# EAGLE board Octal (EAGLE 9.4.1)
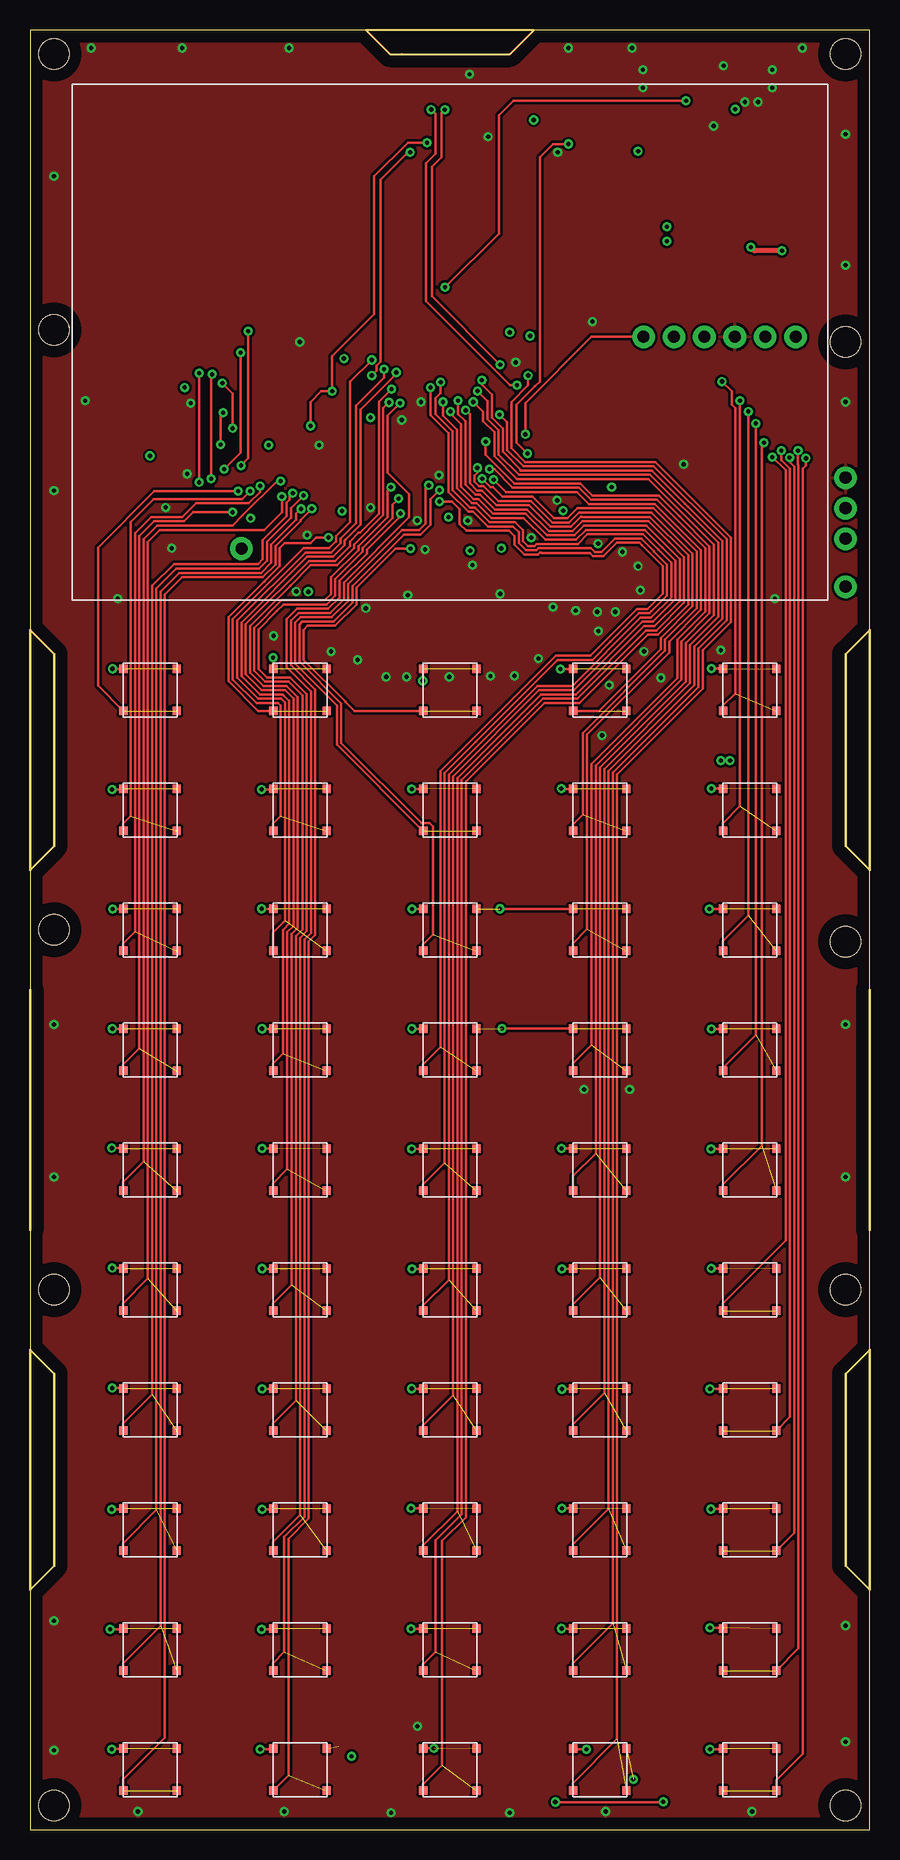
[diagram p6: board, top side]
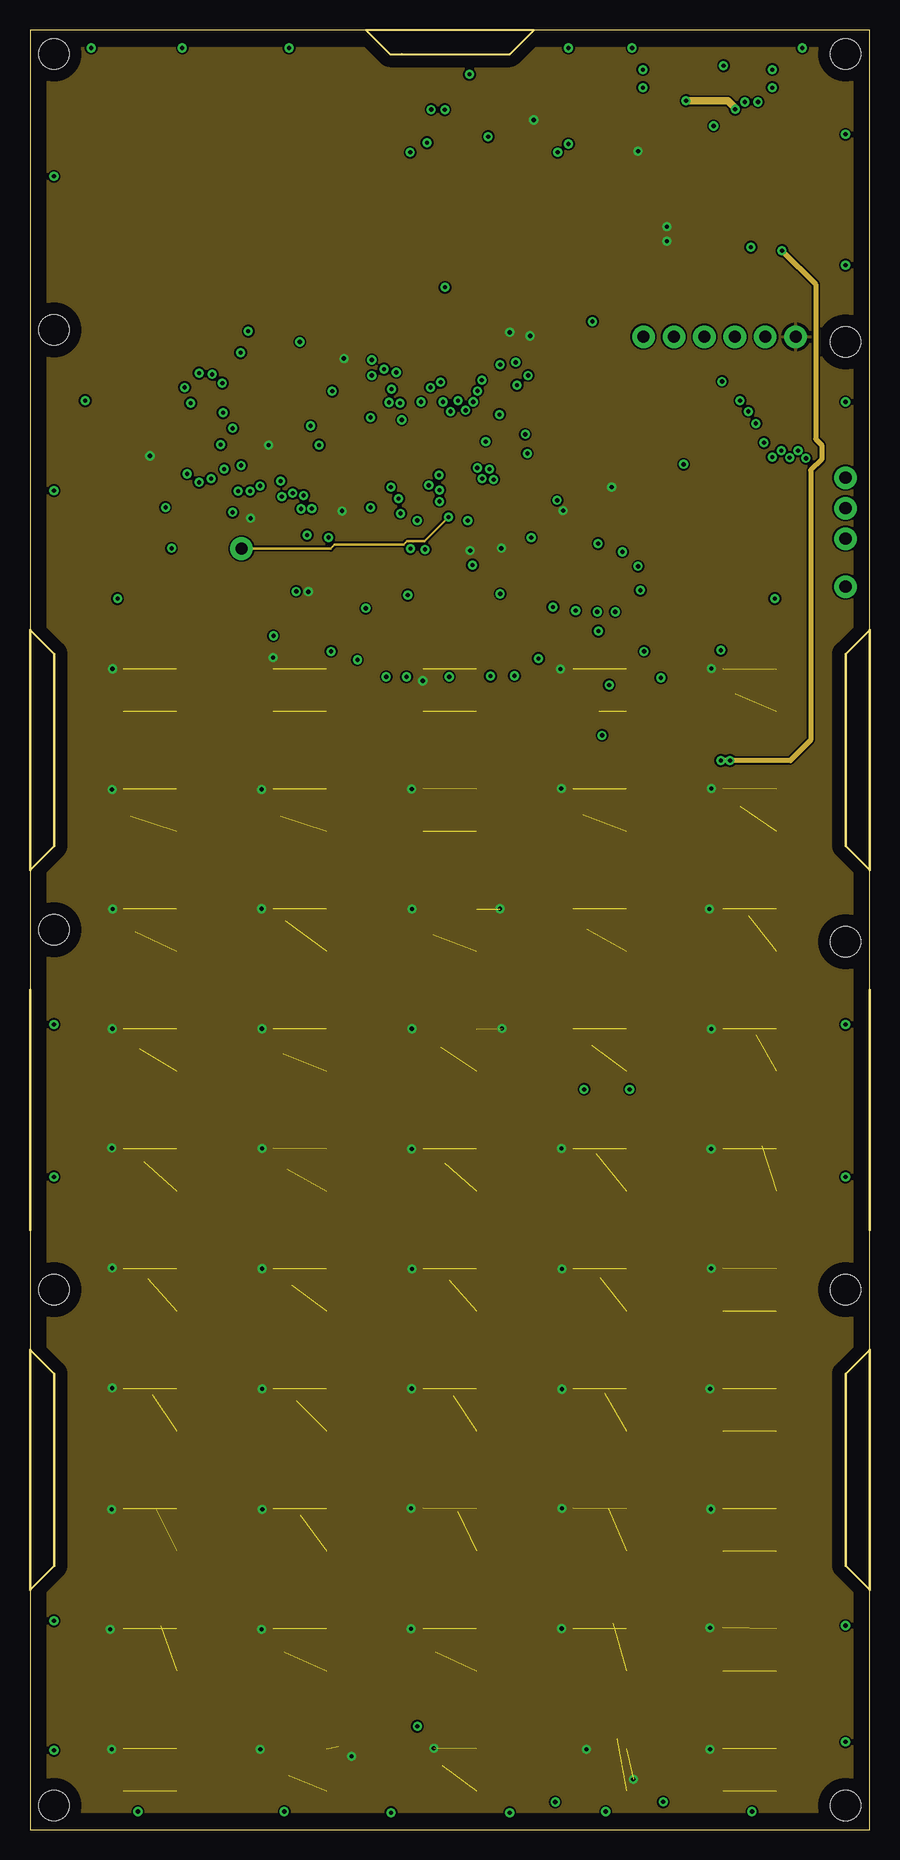
[diagram p7: board, inner layer Route2]
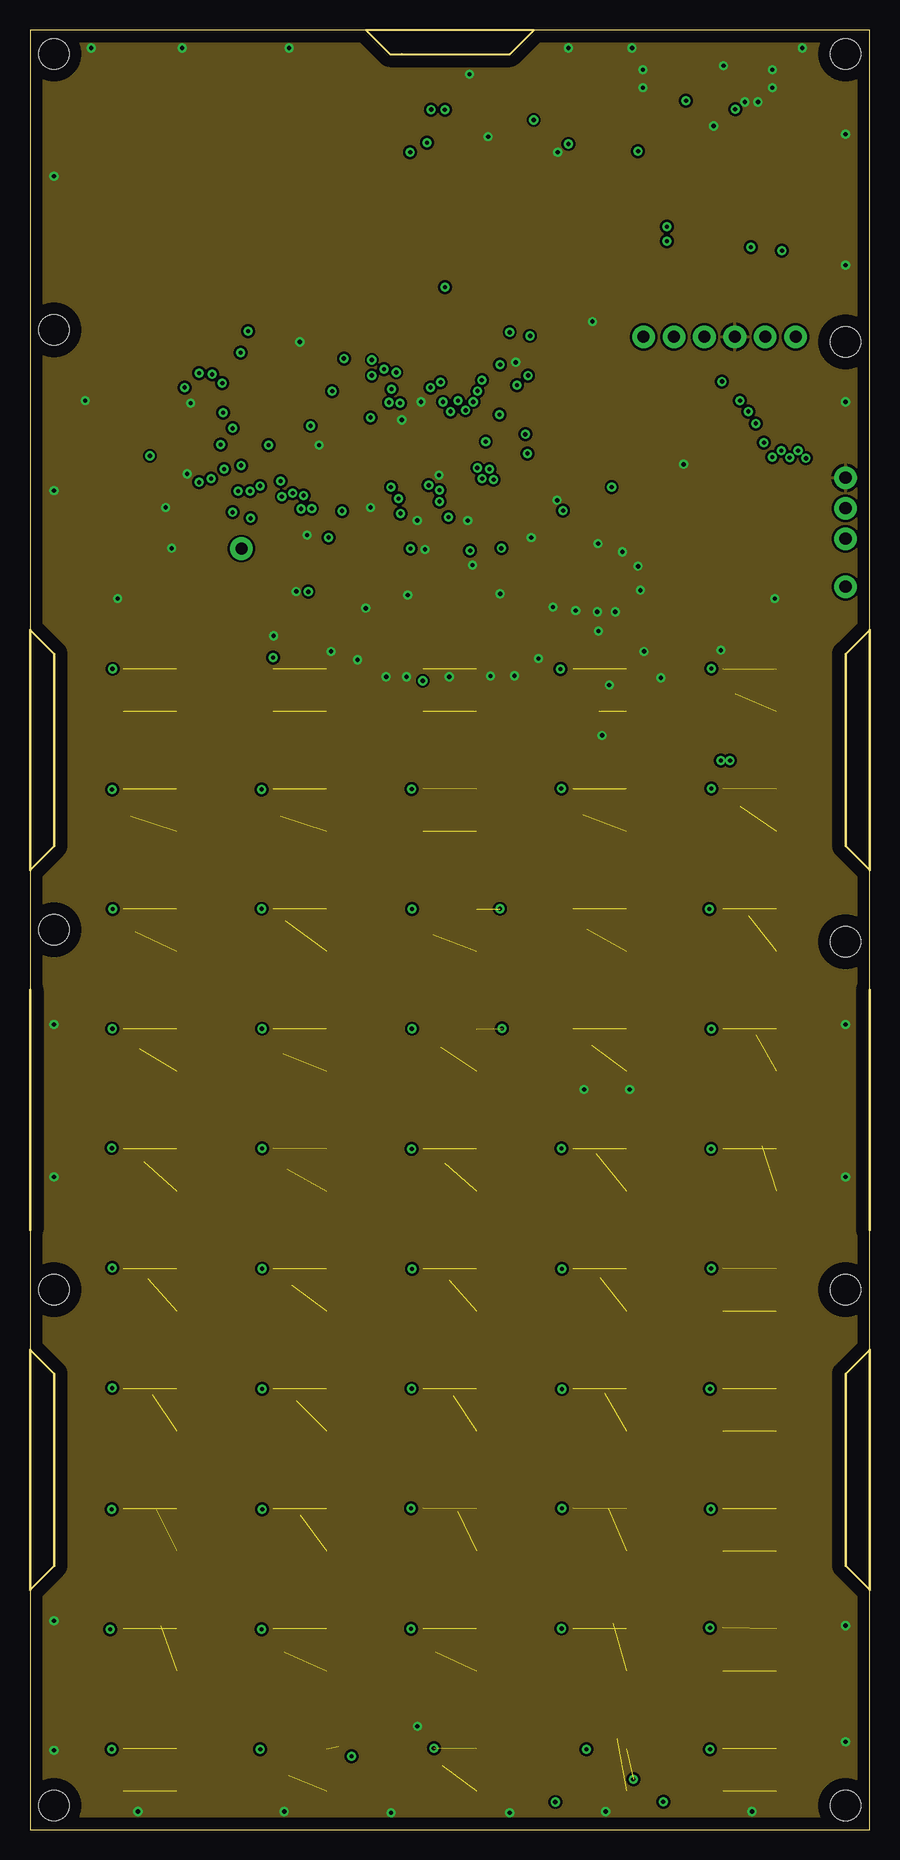
[diagram p8: board, inner layer Route3]
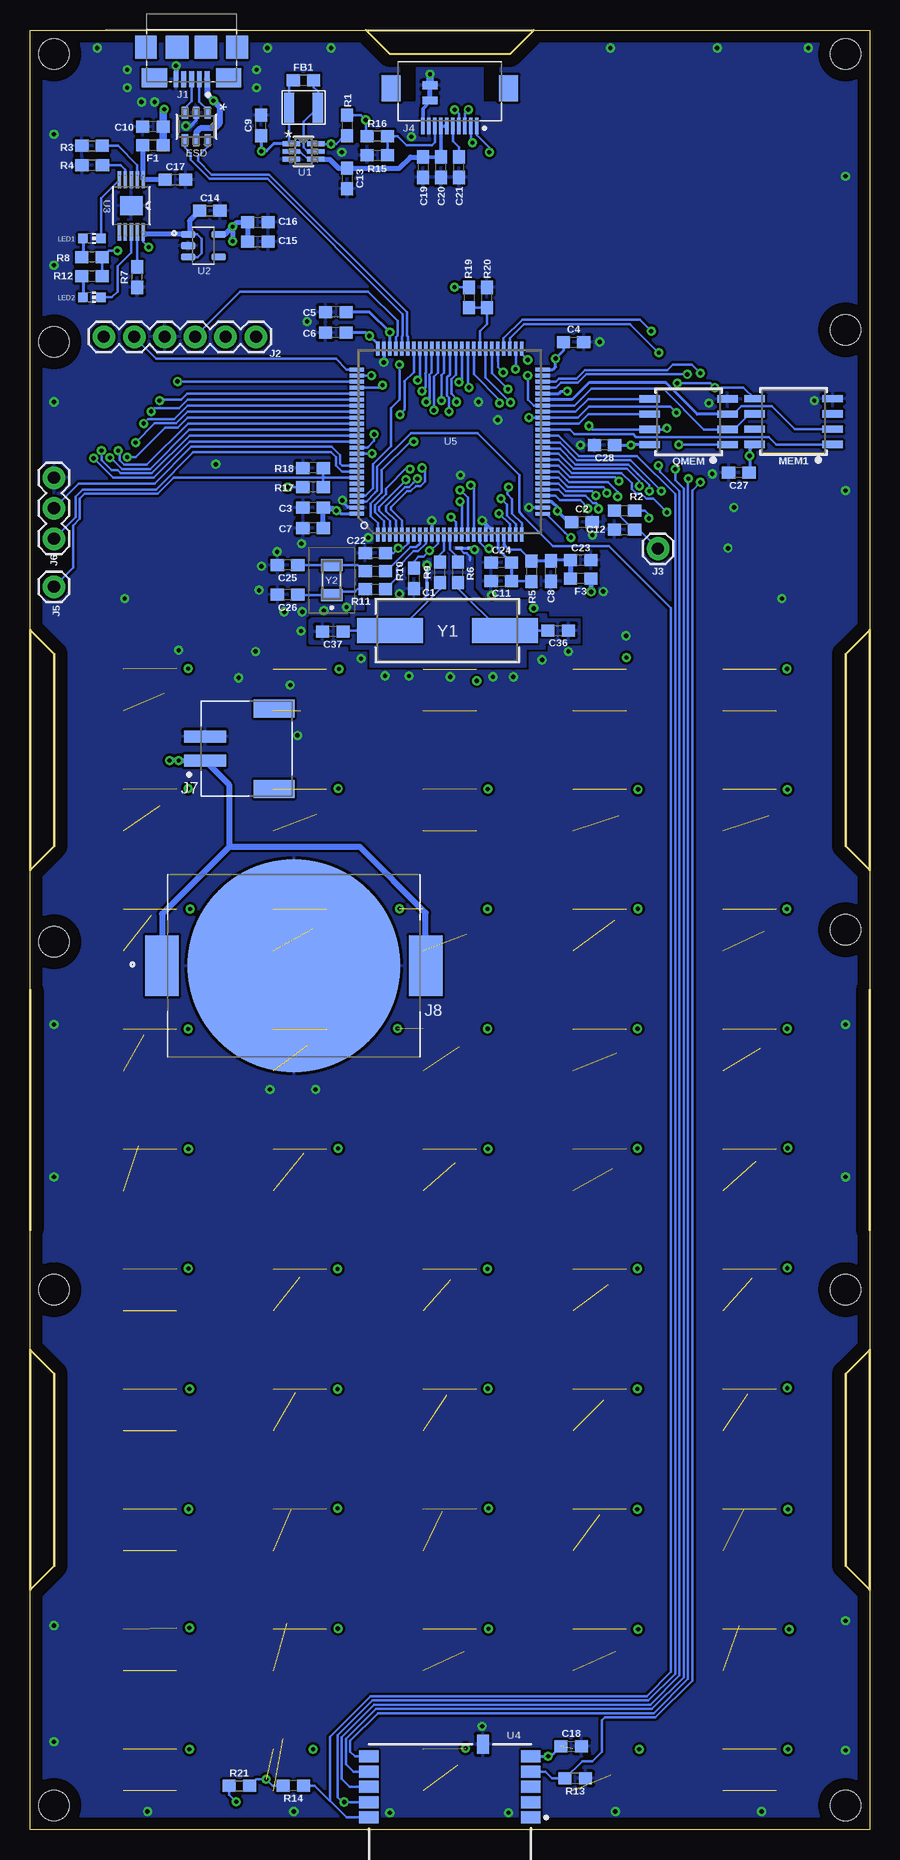
[diagram p9: board, bottom side, seen from below]

Size 70 x 150 mm. Coordinates in mm from the lower left corner, seen from the top.
Outline: 70,20 70,0 0,0 0,20
Outline: 70,20 70,40
Outline: 70,40 70,50
Outline: 70,50 70,70
Outline: 70,70 70,80
Outline: 70,80 70,100
Outline: 70,100 70,150 0,150 0,100
Outline: 0,100 0,80
Outline: 0,80 0,70
Outline: 0,70 0,50
Outline: 0,50 0,40
Outline: 0,40 0,20
Outline: 0,20 2,22 2,38 0,40
Outline: 0,40 0,20
Outline: 0,70 0,68.1 0,52.1 0,50
Outline: 0,70 0,50
Outline: 0,80 2,82 2,98 0,100
Outline: 0,100 0,80
Outline: 70,20 68,22 68,38 70,40
Outline: 70,40 70,20
Outline: 70,50 70,52.2 70,68.2 70,70
Outline: 70,70 70,50
Outline: 70,80 68,82 68,98 70,100
Outline: 70,100 70,80
Copper layers (1*2*3*16): Top 0.035mm / dielectric 0.2mm / Route2 0.035mm / dielectric 0.2mm / Route3 0.035mm / dielectric 0.2mm / Bottom 0.035mm
Design rules "default *": minimum track width 6mil, minimum drill 0.35mm, track to track 6mil, track to pad 6mil, pad to pad 6mil, via to via 6mil, smd to smd 6mil, copper to edge 40mil, drill to drill 6mil, minimum pad ring 10mil, minimum via ring 8mil, stop-mask expansion 4mil, vias tented up to drill 0mil, thermal gap 10mil
Net classes: 1 ground: width 0.203 mm, clearance 0.203 mm; 2 power: width 0.203 mm; 3 cap sense: width 0.178 mm, clearance 0.635 mm; 4 linear regulators: width 1.27 mm, clearance 0.381 mm; 5 diff pair: width 0.203 mm
Holes 2.5 mm at 2,148 68,148 2,2 68,2 2,45 68,45 2,75 68,74 2,125 68,124

## Footprints (pad centres in the part's own frame; a part is rotated, then mirrored left to right if it is on the bottom)
0603 = smd 1.1 x 1: 1 -0.85,0; 2 0.85,0
SPARKFUN-CAPACITORS_0603 = smd 1.1 x 1: 1 -0.85,0; 2 0.85,0
SOT23-6L-L = smd 1.016 x 0.508: 1 -1.143,0.95; 2 -1.143,0; 3 -1.143,-0.95; 4 1.143,-0.95; 5 1.143,0; 6 1.143,0.95
CIG22H4R7MNE = smd 0.85 x 2.5: 1 -1.2,0; 2 1.2,0
AMPHENOL_10118192-0001LF = smd 0.4 x 1.35: 1 -1.3,0; 2 -0.65,0; 3 0,0; 4 0.65,0; 5 1.3,0 | smd 2.1 x 1.6: SH1 -3.1,-0.125; SH2 3.1,-0.125 | smd 1.8 x 1.9: SH3 -3.8,-2.675; SH6 3.8,-2.675 | smd 1.9 x 1.9: SH4 -1.2,-2.675; SH5 1.2,-2.675
1X06 = drill 1.016 pad 1.88: 1 0,0; 2 2.54,0; 3 5.08,0; 4 7.62,0; 5 10.16,0; 6 12.7,0
1X01 = drill 1.016 pad 1.88: 1 0,0
MOLEX_0528921033 = smd 0.3 x 1.4: 1 -2.25,0; 2 -1.75,0; 3 -1.25,0; 4 -0.75,0; 5 -0.25,0; 6 0.25,0; 7 0.75,0; 8 1.25,0; 9 1.75,0; 10 2.25,0 | smd 1.6 x 2.2: 11 -4.9,-3.15; 12 4.9,-3.15
1X03 = drill 1.016 pad 1.88: 1 0,0; 2 2.54,0; 3 5.08,0
JST_S2B-PH-SM4-TB(LF)(SN) = smd 1 x 3.5: 1 -1,0; 2 1,0 | smd 1.5 x 3.4: S1 -3.35,-5.75; S2 3.35,-5.75
MPD_BK-912-TR = smd 2.79 x 5.08: 1 -10.985,0; 2 10.985,0 | smd 17.78 x 17.78: 3 0,0
CHIP-LED0603 = smd 0.8 x 0.8: A 0,-0.75; C 0,0.75
SOIC-8 = smd 0.61 x 1.702: 1 -1.905,-3.251; 2 -0.635,-3.251; 3 0.635,-3.251; 4 1.905,-3.251; 5 1.905,3.251; 6 0.635,3.251; 7 -0.635,3.251; 8 -1.905,3.251
SPARKFUN-RESISTORS_0603:1 = smd 1.1 x 1: 1 -0.85,0; 2 0.85,0
TL3315NF100Q = smd 0.7 x 0.7: 1 -2.225,1.75; 2 2.225,1.75; 3 -2.225,-1.75; 4 2.225,-1.75
2PT_GND_TIE = smd 1.27 x 0.635: P$1 0,0.635; P$2 0,-0.635
DCK6-M = smd 1.457 x 0.405: 1 -1.028,0.65; 2 -1.028,0; 3 -1.028,-0.65; 4 1.028,-0.65; 5 1.028,0; 6 1.028,0.65
SOT95P280X145-5N = smd 1.21 x 0.59: 1 -1.255,0.95; 2 -1.255,0; 3 -1.255,-0.95; 4 1.255,-0.95; 5 1.255,0.95
SOP50P490X110-11N = smd 1.422 x 0.279: 1 -2.184,0.991; 2 -2.184,0.508; 3 -2.184,0; 4 -2.184,-0.508; 5 -2.184,-0.991; 6 2.184,-0.991; 7 2.184,-0.508; 8 2.184,0; 9 2.184,0.508; 10 2.184,0.991 | smd 1.575 x 1.88: 11 0,0
XCVR_SPBTLE-RF = smd 1.6 x 1: 1 -6.75,0.33; 2 -6.75,-0.94; 3 -6.75,-2.21; 4 -6.75,-3.48; 5 -6.75,-4.75; 7 6.75,-4.75; 8 6.75,-3.48; 9 6.75,-2.21; 10 6.75,-0.94; 11 6.75,0.33 | smd 1 x 1.6: 6 -2.75,-5.75
STM32L4_LQFP100 = smd 1.2 x 0.3: BOOT0 -7.75,-3; PA3 7.75,-6.016; PA4 7.75,-4.5; PA5 7.75,-4; PA6 7.75,-3.5; PA7 7.75,-3; PA14 -7.75,6; PA15 -7.75,5.5; PB0 7.75,-1.5; PB1 7.75,-1; PB2 7.75,-0.5; PB3 -7.75,-0.5; PB4 -7.75,-1; PB5 -7.75,-1.5; PB6 -7.75,-2; PB7 -7.75,-2.5; PB8 -7.75,-3.5; PB9 -7.75,-4; PB10 7.75,4.5; PB11 7.75,5; PC4 7.75,-2.5; PC5 7.75,-2; PC10 -7.75,5; PC11 -7.75,4.5; PC12 -7.75,4; PD0 -7.75,3.5; PD1 -7.75,3; PD2 -7.75,2.5; PD3 -7.75,2; PD4 -7.75,1.5; PD5 -7.75,1; PD6 -7.75,0.5; PD7 -7.75,0; PE0 -7.75,-4.5; PE1 -7.75,-5; PE7 7.75,0; PE8 7.75,0.5; PE9 7.75,1; PE10 7.75,1.5; PE11 7.75,2; PE12 7.75,2.5; PE13 7.75,3; PE14 7.75,3.5; PE15 7.75,4; VDD2 -7.75,-6; VDD3 7.75,-4.984; VDD4 7.75,6; VSS2 7.75,-5.5; VSS4 7.75,5.5; VSS5 -7.75,-5.5 | smd 0.3 x 1.2: NRST 0.5,-7.75; PA0 5,-7.75; PA1 5.5,-7.75; PA2 6,-7.75; PA8 -2,7.75; PA9 -2.5,7.75; PA10 -3,7.75; PA11 -3.5,7.75; PA12 -4,7.75; PA13 -4.5,7.75; PB12 6,7.75; PB13 5.5,7.75; PB14 5,7.75; PB15 4.5,7.75; PC0 1,-7.75; PC1 1.5,-7.75; PC2 2,-7.75; PC3 2.5,-7.75; PC6 0,7.75; PC7 -0.5,7.75; PC8 -1,7.75; PC9 -1.5,7.75; PC13 -3,-7.75; PC14/OSC32IN -2.5,-7.75; PC15/OSC32OUT -2,-7.75; PD8 4,7.75; PD9 3.5,7.75; PD10 3,7.75; PD11 2.5,7.75; PD12 2,7.75; PD13 1.5,7.75; PD14 1,7.75; PD15 0.5,7.75; PE2 -6,-7.75; PE3 -5.5,-7.75; PE4 -5,-7.75; PE5 -4.5,-7.75; PE6 -4,-7.75; PH0 -0.5,-7.75; PH1 0,-7.75; VBAT -3.5,-7.75; VDD1 -1,-7.75; VDD5 -6,7.75; VDDA 4.5,-7.75; VDDUSB -5,7.75; VREF+ 4,-7.75; VREF- 3.5,-7.75; VSS1 -1.5,-7.75; VSS3 -5.5,7.75; VSSA 3,-7.75
SHORT = smd 0.635 x 0.254: P$1 -0.508,0; P$2 0.508,0
CRYSTAL_HC49SDLF = smd 5.499 x 2.108: 1 -4.794,0; 2 4.794,0
NX3215SA32768KEXS00AMU00003 = smd 1 x 1.8: 1 -1.25,0; 2 1.25,0

## Placement (x,y rotation side)
C1  0.1uF  [0603]  38,104.3 270 bottom
C2  0.1uF  [0603]  23.98,109 0 bottom
C3  0.1uF  [0603]  46.4,110.18 180 bottom
C4  0.1uF  [0603]  24.68,123.98 0 bottom
C5  0.1uF  [0603]  44.5,126.5 180 bottom
C6  0.1uF  [0603]  44.5,124.77 180 bottom
C7  10uF  [0603]  46.4,108.48 180 bottom
C8  0.1uF  [0603]  26.58,104.9 90 bottom
C9  10uF  [0603]  50.73,142.04 90 bottom
C10  10nF  [0603]  59.75,141.95 180 bottom
C11  0.1uF  [0603]  30.7,104.07 0 bottom
C12  0.1uF  [0603]  20.43,108.34 180 bottom
C13  10uF  [0603]  43.56,137.62 270 bottom
C14  1.0uF  [SPARKFUN-CAPACITORS_0603]  55.01,134.93 0 bottom
C15  1.0uF  [SPARKFUN-CAPACITORS_0603]  51,132.37 0 bottom
C16  10uF  [0603]  51,133.97 0 bottom
C17  1.0uF  [SPARKFUN-CAPACITORS_0603]  57.88,137.53 0 bottom
C18  1.0uF  [SPARKFUN-CAPACITORS_0603]  24.87,6.93 0 bottom
C19  0.1uF  [0603]  37.23,138.56 270 bottom
C20  1.0uF  [0603]  35.73,138.56 90 bottom
C21  0.1uF  [0603]  34.23,138.56 90 bottom
C22  0.1uF  [0603]  41.2,106.4 180 bottom
C23  1.0uF  [0603]  24.08,105.8 180 bottom
C24  1.0uF  [0603]  30.7,105.6 180 bottom
C25  4.7pF  [0603]  48.52,105.4 180 bottom
C26  4.7pF  [0603]  48.52,102.92 180 bottom
C27  0.1uF  [0603]  10.9,113.1 180 bottom
C28  0.1uF  [0603]  22.1,115.4 180 bottom
C36  22pF  [0603]  25.96,99.94 0 bottom
C37  22pF  [0603]  44.75,99.86 180 bottom
ESD  USBLC6-2SC6SOT23-6L-L  [SOT23-6L-L]  56.13,141.95 270 bottom
F1  WE-CBFHF  [0603]  59.75,140.38 180 bottom
F3  WE-CBFHF  [0603]  24.08,104.27 180 bottom
FB1  30Ω/1.8A  [0603]  47.2,145.82 0 bottom
FB2  4.7uH  [CIG22H4R7MNE]  47.2,143.54 0 bottom
J1  10118192-0001LF  [AMPHENOL_10118192-0001LF]  56.53,145.9 180 bottom
J2  [1X06]  63.85,124.43 0 bottom
J3  [1X01]  17.64,106.77 0 bottom
J4  0528921033  [MOLEX_0528921033]  35,142 180 bottom
J5  [1X01]  68,103.6 180 bottom
J6  [1X03]  68,107.6 90 bottom
J7  S2B-PH-SM4-TB(LF)(SN)  [JST_S2B-PH-SM4-TB(LF)(SN)]  55.4,90.1 90 bottom
J8  BK-912-TR  [MPD_BK-912-TR]  48,72 0 bottom
LED1  [CHIP-LED0603]  64.83,132.62 270 bottom
LED2  [CHIP-LED0603]  64.83,127.72 270 bottom
MEM1  W25Q16JV  [SOIC-8]  6.32,117.36 90 bottom
QMEM  W25Q16JV  [SOIC-8]  15.09,117.34 90 bottom
R1  10k  [SPARKFUN-RESISTORS_0603:1]  43.56,142.04 270 bottom
R2  10k  [0603]  20.43,109.93 0 bottom
R3  1.2K  [SPARKFUN-RESISTORS_0603:1]  64.82,140.34 0 bottom
R4  2K  [SPARKFUN-RESISTORS_0603:1]  64.81,138.74 0 bottom
R5  47OHM-KTR10EZPJ4700603  [0603]  28.19,104.87 270 bottom
R6  0OHM0603  [0603]  34.3,104.8 90 bottom
R7  10k  [SPARKFUN-RESISTORS_0603:1]  61.06,129.4 90 bottom
R8  100R  [SPARKFUN-RESISTORS_0603:1]  64.83,131.06 180 bottom
R9  0OHM0603  [0603]  35.8,104.8 90 bottom
R10  0OHM0603  [0603]  41.2,104.9 0 bottom
R11  0OHM0603  [0603]  41.2,103.4 0 bottom
R12  100R  [SPARKFUN-RESISTORS_0603:1]  64.83,129.46 180 bottom
R13  10k  [SPARKFUN-RESISTORS_0603:1]  24.54,4.26 180 bottom
R14  10k  [SPARKFUN-RESISTORS_0603:1]  48.04,3.66 180 bottom
R15  10K0603  [0603]  41.04,139.56 0 bottom
R16  10K0603  [0603]  41.04,141.16 180 bottom
R17  10k  [0603]  46.4,111.9 180 bottom
R18  10k  [0603]  46.4,113.5 180 bottom
R19  10k  [SPARKFUN-RESISTORS_0603:1]  33.4,127.7 270 bottom
R20  30k  [SPARKFUN-RESISTORS_0603:1]  31.9,127.7 90 bottom
R21  10k  [SPARKFUN-RESISTORS_0603:1]  52.55,3.63 0 bottom
S1  TL3315NF100Q  [TL3315NF100Q]  10,5 0 top
S2  TL3315NF100Q  [TL3315NF100Q]  22.5,5 0 top
S3  TL3315NF100Q  [TL3315NF100Q]  35,5 0 top
S4  TL3315NF100Q  [TL3315NF100Q]  47.5,5 0 top
S5  TL3315NF100Q  [TL3315NF100Q]  60,5 0 top
S6  TL3315NF100Q  [TL3315NF100Q]  10,15 0 top
S7  TL3315NF100Q  [TL3315NF100Q]  22.5,15 0 top
S8  TL3315NF100Q  [TL3315NF100Q]  35,15 0 top
S9  TL3315NF100Q  [TL3315NF100Q]  47.5,15 0 top
S10  TL3315NF100Q  [TL3315NF100Q]  60,15 0 top
S11  TL3315NF100Q  [TL3315NF100Q]  10,25 0 top
S12  TL3315NF100Q  [TL3315NF100Q]  22.5,25 0 top
S13  TL3315NF100Q  [TL3315NF100Q]  35,25 0 top
S14  TL3315NF100Q  [TL3315NF100Q]  47.5,25 0 top
S15  TL3315NF100Q  [TL3315NF100Q]  60,25 0 top
S16  TL3315NF100Q  [TL3315NF100Q]  10,35 0 top
S17  TL3315NF100Q  [TL3315NF100Q]  22.5,35 0 top
S18  TL3315NF100Q  [TL3315NF100Q]  35,35 0 top
S19  TL3315NF100Q  [TL3315NF100Q]  47.5,35 0 top
S20  TL3315NF100Q  [TL3315NF100Q]  60,35 0 top
S21  TL3315NF100Q  [TL3315NF100Q]  10,45 0 top
S22  TL3315NF100Q  [TL3315NF100Q]  22.5,45 0 top
S23  TL3315NF100Q  [TL3315NF100Q]  35,45 0 top
S24  TL3315NF100Q  [TL3315NF100Q]  47.5,45 0 top
S25  TL3315NF100Q  [TL3315NF100Q]  60,45 0 top
S26  TL3315NF100Q  [TL3315NF100Q]  10,55 0 top
S27  TL3315NF100Q  [TL3315NF100Q]  22.5,55 0 top
S28  TL3315NF100Q  [TL3315NF100Q]  35,55 0 top
S29  TL3315NF100Q  [TL3315NF100Q]  47.5,55 0 top
S30  TL3315NF100Q  [TL3315NF100Q]  60,55 0 top
S31  TL3315NF100Q  [TL3315NF100Q]  10,65 0 top
S32  TL3315NF100Q  [TL3315NF100Q]  22.5,65 0 top
S33  TL3315NF100Q  [TL3315NF100Q]  35,65 0 top
S34  TL3315NF100Q  [TL3315NF100Q]  47.5,65 0 top
S35  TL3315NF100Q  [TL3315NF100Q]  60,65 0 top
S36  TL3315NF100Q  [TL3315NF100Q]  10,75 0 top
S37  TL3315NF100Q  [TL3315NF100Q]  22.5,75 0 top
S38  TL3315NF100Q  [TL3315NF100Q]  35,75 0 top
S39  TL3315NF100Q  [TL3315NF100Q]  47.5,75 0 top
S40  TL3315NF100Q  [TL3315NF100Q]  60,75 0 top
S41  TL3315NF100Q  [TL3315NF100Q]  10,85 0 top
S42  TL3315NF100Q  [TL3315NF100Q]  22.5,85 0 top
S43  TL3315NF100Q  [TL3315NF100Q]  35,85 0 top
S44  TL3315NF100Q  [TL3315NF100Q]  47.5,85 0 top
S45  TL3315NF100Q  [TL3315NF100Q]  60,85 0 top
S46  TL3315NF100Q  [TL3315NF100Q]  10,95 0 top
S47  TL3315NF100Q  [TL3315NF100Q]  22.5,95 0 top
S48  TL3315NF100Q  [TL3315NF100Q]  35,95 0 top
S49  TL3315NF100Q  [TL3315NF100Q]  47.5,95 0 top
S50  TL3315NF100Q  [TL3315NF100Q]  60,95 0 top
SUPPLY1  2PT_GND_TIE  [2PT_GND_TIE]  36.64,144.76 180 bottom
U1  TPS61222DCKRDCK6-M  [DCK6-M]  47.2,139.87 0 bottom
U2  TLV75533PDBVR  [SOT95P280X145-5N]  55.54,132.02 0 bottom
U3  BQ24092DGQR  [SOP50P490X110-11N]  61.55,135.35 270 bottom
U4  SPBTLE-RF  [XCVR_SPBTLE-RF]  35,1.35 180 bottom
U5  STM32L476VGT6  [STM32L4_LQFP100]  35,115.69 0 bottom
U$2  LS027B7DH01  [LS027B7DH01]  35,124 0 top
U$3  SHORT  [SHORT]  33.7,106.8 0 bottom
U$4  SHORT  [SHORT]  36.91,104.19 90 bottom
Y1  8MHz  [CRYSTAL_HC49SDLF]  35.2,99.94 180 bottom
Y2  NX3215SA-32.768K  [NX3215SA32768KEXS00AMU00003]  44.84,104.15 90 bottom

## Tracks (layer width: path | path; a pad name or v marks a point on that pad's centre or on a via)
3.3V  (via drill 0.35)  (50 unrouted)
  Top 0.203: v6.8,6.7 6.85,6.75 S1.1 | S6.1 7.72,16.7 v6.7,16.7 | S11.1 7.72,26.7 v6.8,26.7 | v6.86,36.8 7.77,36.8 S16.1 | v6.85,46.8 7.78,46.8 S21.1 | v6.83,56.8 7.78,56.8 S26.1 | v6.87,66.75 S31.1 | S36.1 7.75,76.72 v6.89,76.72 | S41.1 7.71,86.69 v6.84,86.69 | v6.88,96.75 S46.1 | v20.27,97.69 S47.1 | S42.1 20.23,86.7 v19.3,86.7 | v19.32,76.75 S37.1 | v19.34,66.75 S32.1 | v19.36,56.76 S27.1 | v19.35,46.75 S22.1 | S17.1 v19.36,36.74 | S12.1 20.23,26.7 v19.37,26.7 | S7.1 20.23,16.7 v19.3,16.7 | v19.2,6.7 20.23,6.7 S2.1 | v33.67,6.77 32.8,6.77 S3.1 | v31.77,16.74 v31.78,16.75 S8.1 | v31.78,26.76 S13.1 | v31.83,36.75 S18.1 | S23.1 32.74,46.72 v31.86,46.72 | S28.1 v31.83,56.74 | v31.84,66.75 S33.1 | S38.1 v31.86,76.74 | v31.83,86.72 32.73,86.72 32.77,86.77 S43.1 | v32.75,95.75 32.75,96.72 S48.1 | v46.4,6.7 45.33,6.7 S4.1 | v44.36,26.76 S14.1 | S19.1 45.23,36.71 v44.35,36.71 | S24.1 v44.36,46.74 | v44.32,56.78 v44.33,56.77 45.27,56.77 S29.1 | v39.36,66.76 S34.1 | v56.7,6.7 57.73,6.7 S5.1 | v56.7,16.8 57.77,16.8 S10.1 | S15.1 57.73,26.71 v56.76,26.71 | S20.1 v56.7,36.74 | v56.8,46.76 S25.1 | S30.1 57.76,56.73 v56.79,56.73 | S35.1 57.76,66.73 v56.82,66.73 | v56.81,86.76 S45.1 | v56.82,96.77 57.77,96.77 S50.1 | S9.1 v44.33,16.75 | v39.19,76.75 S39.1 | S44.1 44.32,86.75 v44.3,86.77 | S40.1 v56.65,76.74 | S49.1 v44.24,96.74
  Bottom 0.203: R17.2 v48.5,111.9 | 18.4,109.22 v18.4,109.3 18.4,109.6 18.73,109.93 R2.2 | R1.1 42.39,142.89 v42,142.5 42,141.27 R16.2 | 24.9,109 C2.1 | FB1.1 48.4,145.47 48.4,143.8 | 48.4,143.8 FB2.1 | U1.1 48.4,140.69 48.4,143.8 | R21.2 51.13,4.2 v50.3,4.2 49.76,3.66 R14.2 | U5.VDD1 36,107.2 36.6,106.6 v36.7,106.6 37.2,106.1 37.6,106.1 38,105.7 C1.1 38,105.3 | 38.5,107.2 38.9,106.8 v39.3,106.8 39.7,106.4 C22.1
  Bottom 0.254: C1.1 38.05,105.18 | U5.VBAT 38.5,107.2 | 45.47,110.1 C3.1 44.69,110.18 v44.45,109.94 44.35,109.94 44.1,109.69 U5.VDD2 | U5.VDDUSB v40,124.8 41.7,126.5 C5.1 | U5.VDD5 41,123.8 v41.7,124.5 41.97,124.77 C6.1 | MEM1.8 10,115.03 v10,114.5 v9.99,114.49 9.99,113.16 C27.1 | QMEM.8 19.86,115.44 v19.9,115.4 C28.1 | C9.1 50.73,139.93 | 50.73,139.93 v50.7,139.9 | U1.1 49.68,140.52 50.27,139.93 50.73,139.93 | C18.1 26.55,6.1 v26.8,6.1 U4.5 | U5.VDD4 26.41,121.69 26.17,121.93 v26.17,122.62 25.53,123.26 C4.1
  Bottom 0.305: U5.VDD3 26.51,110.71 26.01,110.21 v26.01,109.91 25.1,109 24.9,109
  Bottom 0.406: 45.47,110.1 44.61,110.1 | C7.1 C3.1 | F3.1 23.21,104.25 v23.21,103.17 | C15.1 C16.1 52.73,133.97 v53.1,133.6 | U2.5 53.73,132.97 v53.1,133.6 | v53.1,133.6 v53.1,132.4
  pour Route2: 1.5,148.5 68.5,148.5 68.5,1.5 1.5,1.5
5V
  Bottom 0.203: U1.2 47.47,139.87 46.82,139.22 U1.4
  Bottom 0.305: C19.1 C20.2 35.75,139.43 J4.7 J4.6
  Bottom 0.406: U1.4 45.02,139.22 44.27,138.47 C13.1 42.5,138.47 39.23,138.47 38.29,139.41 C19.1
5VUSB
  Bottom 0.406: F1.2 60.56,140.34 U3.1 C17.1
ARTN
  Bottom 0.305: J4.10 37.25,143.45 36.64,144.06 SUPPLY1.P$1
BOOT0
  Bottom 0.203: R18.1 45.55,112.74 45.5,112.69 | R17.1 45.55,112.64 | 45.55,112.64 45.5,112.69 | J5.1 66.4,105.2 66.4,108.7 65.84,109.25 65.84,110.95 65.45,111.34 59.35,111.34 58.01,112.69 45.5,112.69 | 45.5,112.69 45.55,112.64 | U5.BOOT0 45.5,112.69
D+
  Bottom 0.203: J1.3 56.53,144.07 57.08,143.52 ESD.3
D-
  Bottom 0.203: J1.2 55.88,144.04 55.18,143.34 ESD.1
GND  (via drill 0.35)
  Bottom 0.203: U5.VSS2 v28.4,110.2 | U$4.P$2 v36.91,105.39 v36.9,105.4 | v32.95,106.7 33.05,106.8 U$3.P$2
  Bottom 0.254: U5.VSS3 v40.5,122.3 | U5.VSS5 42.77,110.21 43.49,110.21 43.95,110.67 v43.95,110.8
  Bottom 0.305: ESD.2 56.13,142.47 56.6,142 v57,142 | U5.VREF- 31.5,108.33 v32.29,109.12 32,108.83 U5.VSSA | v36.5,109.1 U5.VSS1
  Bottom 0.406: v57.83,147.03 J1.5
  Bottom 0.61: v36.64,146.3 SUPPLY1.P$2
  other vias: 46.9,125.7 22.5,124 13.1,113 13.4,118.9 22.2,103.2 28,101.8 39.2,103 50.9,103.3 47.4,99.9 50.7,105.3 41.79,107.68 47.37,107.18 25.1,98.2 30.1,1.4 32.3,8.6 40,1.4 24.1,115.4 23.1,107.9 59.6,144 32.6,119 31.5,102.9 27.3,97.5 29.7,96.08 31.4,96.08 38.4,96.15 40.4,96.17 42.4,97.6 47.3,101.5 43.6,101.9 45.5,101.6 48.8,101.5 49.4,106.5 34.96,96.08 60.7,144 51.1,146.7 51.1,145.2 64.4,148.5 50.2,148.5 44.9,148.5 21.6,148.5 12.7,148.5 5.1,148.5 2,137.8 2,111.6 2,67.1 2,54.4 2,17.4 2,6.6 9,1.5 21.2,1.5 60.2,1.5 68,7.3 68,17 68,54.4 68,67.1 68,119 68,130.4 68,141.3 48,1.5 31,117.5 34.1,112.9 61.9,146.7 61.9,145.2 44,139.8 4.6,119.1 54.5,113.8 38.2,141.1 50,61.7 46.2,61.7 7.3,102.6 11.8,106.8 62.1,102.6 52.6,96 47.7,91.2 48.3,95.4 51.2,98.2 57.6,98.3 20.3,99.5 11.3,110.2
  pour Route3: 0,150 70,150 70,0 0,0
  pour Bottom (rank 2): 0,150 70,150 70,0 0,0
  pour Top: 0,150 70,150 70,0 0,0
GUARDGND
  Bottom 0.203: U$3.P$1 33.81,106.4 33.6,106.4 33.3,106.1 33.3,105.8 | U$4.P$1 36.91,102.91 36.9,102.9 37.3,102.5
  pour Bottom (isolate 0.17): 24.2,100.9 24.2,98.9 27.1,98.9 27.1,98.4 28.7,98.4 28.7,96.9 41.6,96.9 41.6,98.3 41.7,98.4 43.2,98.4 43.2,98.8 46.6,98.8 46.7,98.9 46.7,100.8 46.5,101 43.2,101 43.2,101.4 41.8,101.4 41.8,102.5 37.2,102.5 36.9,102.8 36.9,105.8 35.8,106.9 34,106.9 33.1,106 33.1,103.3 32.3,102.5 28.6,102.5 28.6,101.4 28.5,101.3 27,101.3 27,100.9
LI-ION  (via drill 0.35)
  Top 0.406: v62.7,131.6 60.4,131.6 v60.1,131.9
  Route2 0.406: v62.7,131.6 65.5,128.8 65.5,115.9 66,115.4 66,114.2 65.1,113.3 65.1,90.8 63.4,89.1 v57.6,89.1
  Bottom 0.203: U2.3 56.03,131.07 55.7,131.4 55.7,132.6 56.07,132.97 56.7,132.97 U2.1 | U3.10 60.56,132.36 v60.1,131.9 | v62.7,131.6 63.44,131.6 R8.1 R12.1
  Bottom 0.406: U2.1 60.36,132.97 U3.10 | C14.1 56.7,134.09 56.7,132.97 | J7.1 v57.6,89.1 v58.37,89.1
  Bottom 0.508: J8.2 37.02,76.42 42.5,81.9 53.4,81.9 | J8.1 58.98,76.31 53.4,81.9 | J7.1 53.4,87.1 53.4,81.9
N$1
  Bottom 0.203: 30.35,106.95 30.1,106.7 29.11,106.7 28.16,105.75
  Bottom 0.254: U5.VDDA 30.5,107.1 30.35,106.95 | C23.2 26.53,105.8 C8.2 28.16,105.75 R5.1
  Bottom 0.406: C23.2 F3.2
N$2
  Bottom 0.203: R5.2 28.24,104.07 C11.2
  Bottom 0.254: U5.VREF+ 31,106.75 C24.1 C11.2
N$5
  Bottom 0.203: FB1.2 46.35,145.25 46,144.9 FB2.2 47.2,142.34 47.2,140.22 46.85,139.87 U1.5
N$6
  Bottom 0.203: U3.2 61.04,138.74 62.64,140.34 R3.2
N$8
  Bottom 0.203: U5.PH0 35.5,106.6 36,106.1 R9.2
N$10
  Bottom 0.203: U3.9 61.04,131.96 61.06,131.94 R7.2
N$11
  Bottom 0.203: R4.2 62.44,138.74 62.06,138.36 U3.4
N$12
  Bottom 0.203: U3.5 64.08,136 LED1.C
N$13
  Bottom 0.152: Y1.2 39.26,99.94
  Bottom 0.203: R9.1 35.8,103.4 39.26,99.94 | C37.1 43.82,99.94 Y1.2
N$14
  Bottom 0.203: R6.1 34.3,103.44 30.7,99.84 30.5,99.84 Y1.1 C36.1
N$17
  Bottom 0.203: U5.PH1 35,106.7 34.49,106.19 R6.2
N$18
  Bottom 0.203: R11.1 42.7,103.4 42.9,103.2 44.54,103.2 Y2.1 47.65,102.9 C26.1
N$19
  Bottom 0.203: R10.1 42.2,104.9 42.7,105.4 Y2.2 C25.1
N$20
  Bottom 0.203: U5.PC15/OSC32OUT 37,107.2 37.65,106.54 38.01,106.54 39.4,105.16 39.4,104.35 R11.2
N$21
  Bottom 0.203: U5.PC14/OSC32IN 37.5,107.2 37.8,106.9 38.26,106.9 40.26,104.9 R10.2
N$22
  Bottom 0.203: U3.8 61.55,131.45 62.7,130.3 62.7,128.2 63.18,127.72 LED2.C
N$24
  Bottom 0.254: LED1.A 65.58,131.16 R8.2
N$25
  Bottom 0.254: R12.2 65.58,129.36 LED2.A
N$39
  Bottom 0.203: J4.5 34.75,140.75 34.23,140.23 C21.2
N$42
  Bottom 0.203: J4.8 36.25,140.65 36.5,140.4 38.6,140.4 39.36,141.16 R16.1 R15.2
NRST1  (via drill 0.35)
  Route2 0.203: v34.9,109.4 32.89,107.39 31.46,107.39 31.16,107.1 25.4,107.1 25.07,106.77 J3.1
  Bottom 0.203: U5.NRST 34.5,109 v34.9,109.4 | R2.1 19.69,108.34 C12.1 19.21,108.34 J3.1
PA0  (via drill 0.35)  (1 unrouted)
  Top 0.203: v30.9,109.7 30.9,109.49 28.09,106.68 28.09,106.37 25.81,104.09 25.81,102.7 24.86,101.76 22.26,101.76 21.4,100.9 21.4,96.9 23.43,94.87 23.43,87.6 23.43,74.73 22.88,74.17 22.88,26.07 21.2,24.4 21.2,14.8 20.27,13.88 S7.3
  Bottom 0.203: U5.PA0 30,108.8 v30.9,109.7
PA1  (via drill 0.35)  (1 unrouted)
  Top 0.203: v30.74,110.94 30.24,110.44 30.24,109.33 27.75,106.85 | S12.3 20.27,23.98 22.52,26.22 22.52,74.32 23.08,74.88 23.08,94.66 21.7,96.03 19.77,96.03 19.05,96.75 19.05,100.02 20.58,101.54 21.14,102.11 24.71,102.11 25.46,102.85 | 27.73,106.83 27.75,106.85 | 25.46,102.85 25.46,103 | 25.46,103 25.46,104.24 27.73,106.52 27.73,106.83 | 27.73,106.83 27.75,106.85 | 25.46,102.85 25.46,103
  Bottom 0.203: v30.74,110.94 30.23,110.43 30.23,109.53 29.5,108.8 U5.PA1
PA2  (via drill 0.35)  (1 unrouted)
  Top 0.203: v30.09,111.9 29.81,111.62 29.81,109.41 29.15,108.75 27.38,106.97 27.38,106.66 25.1,104.39 25.1,103 24.57,102.47 21,102.47 18.69,100.17 18.69,96.6 19.62,95.68 21.55,95.68 22.72,94.51 22.72,88.52 22.72,75.02 22.17,74.47 22.17,35.77 20.27,33.88 S17.3
  Bottom 0.203: v30.09,111.9 30.2,111.79 30.2,111.3 29.8,110.9 29.8,109.7 29,108.9 U5.PA2
PA3  (via drill 0.35)  (1 unrouted)
  Top 0.203: 19.55,104.03 19.56,104.04 | 19.56,104.04 20.82,105.31 20.82,106.82 21.22,107.22 23.38,107.22 23.87,107.7 v24.9,107.7 | S47.3 19.03,93.25 16.56,95.72 16.56,101.05 19.56,104.04
  Bottom 0.203: v24.9,107.7 25,107.7 25.4,108.1 26.97,109.67 U5.PA3
PA4  (via drill 0.35)  (1 unrouted)
  Top 0.203: v23.5,110.1 22.56,109.15 22.56,109.05 20.47,106.96 20.47,105.46 19.4,104.39 19.3,104.39 12.69,104.39 11.24,102.94 11.24,7.64 7.78,4.17 S1.3
  Bottom 0.203: U5.PA4 26.19,111.19 25.8,110.8 24.1,110.8 23.5,110.2 v23.5,110.1
PA5  (via drill 0.35)  (1 unrouted)
  Top 0.203: v22.59,110.08 22.2,109.69 22.2,109.2 20.11,107.11 20.11,105.61 19.25,104.74 19.2,104.74 12.44,104.74 10.89,103.19 10.89,16.99 7.78,13.88 S6.3
  Bottom 0.203: U5.PA5 25.95,111.69 25.45,111.19 23.7,111.19 23.45,110.94 23.08,110.57 22.77,110.57 22.59,110.39 v22.59,110.08
PA6  (via drill 0.35)  (1 unrouted)
  Top 0.203: v22.82,111.2 21.76,110.14 21.76,109.35 19.76,107.35 19.76,105.75 19.1,105.1 12.2,105.1 10.53,103.43 10.53,26.63 7.78,23.88 S11.3
  Bottom 0.203: U5.PA6 25.94,112.19 25.3,111.54 23.1,111.54 22.82,111.26 v22.82,111.2
PA7  (via drill 0.35)  (1 unrouted)
  Top 0.203: v21.91,111.4 21.63,111.12 21.63,110.84 21.4,110.61 21.4,109.5 19.4,107.5 19.4,105.9 19,105.5 12,105.5 10.18,103.68 10.18,36.28 7.78,33.88 S16.3
  Bottom 0.203: U5.PA7 25.94,112.69 25.26,112.01 25.15,111.9 22.2,111.9 21.91,111.61 v21.91,111.4
PA8  (via drill 0.35)  (1 unrouted)
  Top 0.203: S19.3 45.27,33.77 47.88,36.38 47.88,88.39 55.03,95.54 55.03,98.74 57.38,101.09 57.38,107.25 51.7,112.93 40.9,112.93 | 40.9,112.93 40.76,112.93 | v37.32,119.91 38.14,119.08 38.14,117.55 39.07,116.63 39.07,114.62 40.76,112.93 | 40.76,112.93 40.9,112.93
  Bottom 0.203: v37.32,119.91 37.04,120.19 37.04,121.4 37,121.44 U5.PA8
PA9  (via drill 0.35)  (1 unrouted)
  Top 0.203: v37.67,120.82 37.67,120.45 38.5,119.62 38.5,117.7 39.42,116.78 39.42,114.84 40.98,113.29 41.1,113.29 | S14.3 45.27,23.77 48.23,26.73 48.23,88.24 55.39,95.39 55.39,98.59 57.73,100.94 57.73,107.4 54.87,110.27 | 54.87,110.27 54.59,110.54 | 54.87,110.27 51.85,113.29 41.1,113.29 | 40.91,113.29 41.1,113.29
  Bottom 0.203: v37.67,120.82 37.5,120.99 U5.PA9
PA10  (via drill 0.35)  (1 unrouted)
  Top 0.203: S9.3 45.27,13.88 48.59,17.19 48.59,87.5 | 48.59,87.69 48.59,87.5 | 48.59,87.5 48.59,88.09 55.74,95.25 55.74,98.45 58.09,100.79 58.09,107.55 52,113.64 43.6,113.64 | 43.56,113.64 43.6,113.64 | v39.15,117.95 39.78,117.32 39.78,114.99 41.13,113.64 43.6,113.64
  Bottom 0.203: v39.15,117.95 38.75,118.35 38.75,120.75 38,121.5 U5.PA10
PA13
  Bottom 0.203: U5.PA13 39.5,124.41 39.37,124.54 39.37,125.77 41.8,128.2 52.46,128.2 J2.4
PA14
  Bottom 0.203: U5.PA14 43.59,121.69 44.5,122.6 59.5,122.6 61.31,124.41 J2.2
PA15  (via drill 0.35)  (1 unrouted)
  Top 0.203: v41.54,121.2 41.54,120.4 40.14,119 40.14,115.14 41.27,114 52.14,114 58.44,107.7 58.44,100.64 56.1,98.3 56.1,95.1 48.95,87.94 48.95,7.54 45.27,3.88 S4.3
  Bottom 0.203: U5.PA15 41.53,121.19 v41.54,121.2
PB0  (via drill 0.35)  (1 unrouted)
  Top 0.203: v16.9,109.8 13.6,109.8 12.85,109.04 10.34,109.04 9.11,107.81 9.11,65.11 7.78,63.77 S31.3
  Bottom 0.203: U5.PB0 25.93,114.19 24.82,113.08 20.68,113.08 19.82,112.22 19.82,111.73 19.45,111.36 19.05,111.36 18.61,110.92 18.02,110.92 v16.9,109.8
PB1  (via drill 0.35)  (1 unrouted)
  Top 0.203: v19.19,111.99 19.19,111.49 18.24,110.54 13.84,110.54 12.7,109.4 10.1,109.4 8.76,108.05 8.76,74.86 7.78,73.88 S36.3
  Bottom 0.203: U5.PB1 25.93,114.69 24.67,113.43 20.24,113.43 19.19,112.39 v19.19,111.99
PB2  (via drill 0.35)  (1 unrouted)
  Top 0.203: v18.35,111.55 17.69,110.9 10.3,110.9 8.4,109 8.4,84.5 7.78,83.88 S41.3
  Bottom 0.203: U5.PB2 27.15,115.09 25.83,115.09 24.53,113.79 20.09,113.79 19.3,113 18.35,112.04 v18.35,111.55
PB3  (via drill 0.35)
  Top 0.203: v41.3,116.3 41.3,118.9 46.83,124.43 J2.6
  Bottom 0.203: U5.PB3 41.87,115.19 41.83,115.24 41.3,115.76 v41.3,116.3
PB4  (via drill 0.35)
  Top 0.203: v41.47,114.7 40.57,115.6 40.57,118.77 42.1,120.3 42.5,120.7 42.5,135.5 42.5,139.4 43.6,140.5 v44.9,140.5
  Bottom 0.203: R1.2 43.81,141.19 44.5,140.5 v44.9,140.5 46.15,140.5 U1.6 | U5.PB4 v41.48,114.69 v41.47,114.7
PB6
  Bottom 0.203: U5.PB6 43.99,113.69 44.14,113.85 44.14,114.55 44.85,115.26 56.54,115.26 59.6,112.2 65.94,112.2 J6.2
PB7
  Bottom 0.203: U5.PB7 43.99,113.19 44.5,113.7 44.5,114.4 44.9,114.8 50.6,114.8 56.4,114.8 59.5,111.7 61,111.7 65.6,111.7 66.2,111.1 66.2,109.8 66.2,109.4 J6.1
PB10  (via drill 0.35)
  Top 0.203: v15.1,112.6 15.1,121.2 v15.2,121.3
  Bottom 0.203: U4.7 42.9,6.1 43.3,6.5 43.3,7.4 41,9.7 17.99,9.7 15.13,12.56 15.13,112.57 v15.1,112.6 | v15.2,121.3 23.6,121.3 24.3,120.6 25.74,120.6 26.15,120.19 U5.PB10
PB11  (via drill 0.35)
  Top 0.203: v14.1,112.3 v14.1,121.4
  Bottom 0.203: U4.4 27.03,4.83 26.46,4.26 R13.2 23.95,5.7 23.1,5.7 22.3,6.5 22.3,9.1 22.06,9.34 17.84,9.34 14.78,12.41 14.78,111.62 v14.1,112.3 | v14.1,121.4 14.8,122.1 16.4,122.1 16.84,121.66 23.75,121.66 24.45,120.96 25.89,120.96 26.15,120.69 U5.PB11
PB12  (via drill 0.35)  (1 unrouted)
  Top 0.203: v28.5,122.5 26.7,120.7 26.7,109 25.53,107.83 25.53,107.4 | S42.3 20.27,83.88 20.9,84.5 20.9,93.7 20.7,93.9 18.88,93.9 16.92,95.87 16.92,100.9 22.81,106.8 24.93,106.8 25.53,107.4 | 25.53,107.37 25.53,107.4
  Bottom 0.203: U5.PB12 29,123 v28.5,122.5
PB13  (via drill 0.35)  (1 unrouted)
  Top 0.203: v29.53,121.73 29.53,121.03 27.2,118.7 27.2,108.9 25.89,107.59 25.89,107.22 25.11,106.44 22.96,106.44 17.27,100.75 17.27,96.01 19.03,94.26 20.92,94.26 21.26,93.92 21.26,75.76 21.15,75.65 | S37.3 20.27,74.78 21.15,75.65 | 21.15,75.65 21.16,75.66 21.15,75.65
  Bottom 0.203: U5.PB13 29.5,121.76 v29.53,121.73
PB14  (via drill 0.35)
  Top 0.203: v17.57,123.1 17.57,114.77 v16.2,113.4
  Bottom 0.203: U4.8 43.03,4.83 43.66,5.46 43.66,7.4 43.66,7.55 41.15,10.06 18.14,10.06 15.49,12.71 15.49,111.79 16.2,112.5 v16.2,113.4 | U5.PB14 30,124.3 28.8,125.5 20,125.5 17.6,123.1 v17.57,123.1
PB15  (via drill 0.35)
  Top 0.203: v18.2,124.9 18.2,114.3 v17.6,113.7
  Bottom 0.203: U4.9 43.36,3.56 44.01,4.21 44.01,7.4 44.01,7.7 41.3,10.41 18.29,10.41 15.84,12.85 15.84,111.54 17.5,113.2 17.5,113.6 v17.6,113.7 | U5.PB15 30.5,124.3 28.95,125.86 19.15,125.86 v18.2,124.9
PC0  (via drill 0.35)  (1 unrouted)
  Top 0.203: S33.3 32.77,63.77 34.21,65.21 34.21,88.23 43.84,97.86 46.74,97.86 50.62,101.73 51.49,101.73 52.76,103 52.76,105.31 51,107.07 51,107.08 50.81,107.27 48.92,107.27 47.8,106.14 46.94,106.14 46.68,106.4 42.7,106.4 42.65,106.45 42.54,106.45 42.37,106.29 41.21,106.29 40.4,107.1 40.4,107.8 39.94,108.25 36.38,108.25 35.82,108.82 35.82,110.07 35.19,110.7 v34.14,110.7
  Bottom 0.203: U5.PC0 34,110.56 v34.14,110.7
PC1  (via drill 0.35)  (1 unrouted)
  Top 0.203: S38.3 32.77,73.78 33.6,74.6 33.6,83.6 33.3,83.9 33,83.9 32.63,83.9 25.96,90.57 25.96,93.85 22.47,97.34 22.47,100.46 22.7,100.69 25.3,100.69 26.88,102.26 26.88,103.65 31.17,107.94 32.58,107.94 33.4,108.76 33.4,110.92 v34.14,111.66
  Bottom 0.203: U5.PC1 33.5,111.02 v34.14,111.66
PC2  (via drill 0.35)  (1 unrouted)
  Top 0.203: S43.3 25.6,90.42 25.6,93.71 22.11,97.19 22.11,100.61 22.55,101.05 25.16,101.05 26.52,102.41 26.52,103.8 31.03,108.3 32.44,108.3 32.97,108.84 32.97,111.77 v33.25,112.05
  Bottom 0.203: U5.PC2 33,111.8 v33.25,112.05
PC3  (via drill 0.35)  (1 unrouted)
  Top 0.203: S48.3 27.05,93.25 26.31,93.99 26.31,94 22.82,97.49 22.82,100 23.16,100.33 25.45,100.33 27.23,102.12 27.23,103.5 30.49,106.76 v31.72,106.76
  Bottom 0.203: U5.PC3 32.5,107.26 32.04,106.8 31.9,106.8 31.86,106.76 v31.72,106.76
PC4  (via drill 0.35)  (1 unrouted)
  Top 0.203: v21,111.1 21,109.8 19.53,108.33 10.83,108.33 9.82,107.32 9.82,45.92 7.78,43.88 S21.3
  Bottom 0.203: U5.PC4 25.94,113.19 25.21,112.47 25.05,112.3 21.8,112.3 21,111.5 v21,111.1
PC5  (via drill 0.35)  (1 unrouted)
  Top 0.203: v20.9,112.4 20.6,112.4 17.75,109.54 17.74,109.54 16.89,108.69 10.59,108.69 9.47,107.57 9.47,55.67 7.78,53.98 S26.3
  Bottom 0.203: U5.PC5 25.94,113.69 24.97,112.72 21.22,112.72 v20.9,112.4
PC6  (via drill 0.35)  (1 unrouted)
  Top 0.203: S13.3 32.77,23.68 35.63,26.53 35.63,87.3 35.63,87.64 42.6,94.61 45.51,94.61 51.2,100.31 52.08,100.31 54.18,102.41 54.18,105.92 51.41,108.69 46.2,108.69 45.39,107.88 43.11,107.88 41.31,109.68 38.61,109.68 37.39,110.9 37,110.9 35.96,111.94 35.96,117.14 35.06,118.03 v35.06,118.2
  Bottom 0.203: U5.PC6 34.99,121.29 35.23,121.05 35.23,119.53 35.06,119.36 v35.06,118.2
PC7  (via drill 0.35)  (1 unrouted)
  Top 0.203: v35.7,119.1 35.7,118 36.31,117.38 36.31,112.09 37.14,111.26 37.53,111.26 38.76,110.03 41.46,110.03 43.26,108.23 45.24,108.23 46.05,109.04 51.55,109.04 53.3,107.3 | S8.3 32.77,13.78 33.8,14.8 33.8,24.1 35.99,26.29 35.99,87.3 35.99,87.49 42.75,94.26 45.65,94.26 51.35,99.96 52.22,99.96 54.53,102.27 54.53,106.06 53.3,107.3 | 53.26,107.34 53.3,107.3
  Bottom 0.203: U5.PC7 35.49,123.43 35.49,121.44 35.7,121.23 v35.7,119.1
PC8  (via drill 0.35)  (1 unrouted)
  Top 0.203: S3.3 32.77,3.77 34.36,5.36 34.36,24.05 36.34,26.04 36.34,87.34 42.9,93.9 45.8,93.9 51.5,99.6 52.37,99.6 54.89,102.12 54.89,106.21 51.7,109.4 46,109.4 45.98,109.42 45.93,109.42 45.09,108.59 43.41,108.59 41.6,110.39 38.9,110.39 37.68,111.61 37.29,111.61 36.67,112.23 36.67,117.96 v36.33,118.3
  Bottom 0.203: v36.33,118.3 36.33,121.11 36,121.43 U5.PC8
PC9  (via drill 0.35)  (1 unrouted)
  Top 0.203: S24.3 45.27,43.77 47.52,46.02 47.52,88.53 54.68,95.69 54.68,98.89 57.02,101.23 57.02,107.11 51.55,112.58 41.1,112.58 | 41.1,112.58 40.61,112.58 | v36.96,119 37.79,118.17 37.79,117.41 38.71,116.48 38.71,114.48 40.61,112.58 | 40.61,112.58 41.1,112.58
  Bottom 0.203: U5.PC9 36.51,121.43 36.68,121.25 36.68,119.28 v36.96,119
PC10  (via drill 0.35)  (1 unrouted)
  Top 0.203: v57.7,120.7 58.5,119.9 58.5,118.78 58.8,118.47 58.8,94.7 57.77,93.67 S50.3
  Bottom 0.203: U5.PC10 v57.69,120.69 v57.7,120.7
PC11  (via drill 0.35)
  Top 0.203: v40.6,120.4 40,120.4 33,127.4 33,138.9 33.8,139.7 33.8,143.02 v33.45,143.37
  Bottom 0.203: U5.PC11 40.81,120.19 v40.6,120.4 | v33.45,143.37 33.75,143.07 J4.3
PC12  (via drill 0.35)  (1 unrouted)
  Top 0.203: v59.2,119.1 59.2,85.3 57.77,83.88 S45.3
  Bottom 0.152: 59.1,119.2 v59.2,119.1
  Bottom 0.203: U5.PC12 56.91,119.69 57.4,119.2 59.1,119.2
PD0  (via drill 0.35)  (1 unrouted)
  Top 0.203: v59.9,118.2 59.9,117.7 59.9,76.2 57.77,74.08 S40.3
  Bottom 0.203: U5.PD0 56.84,119.19 57.56,118.47 59.63,118.47 v59.9,118.2
PD1  (via drill 0.35)  (1 unrouted)
  Top 0.203: S35.3 57.77,63.48 60.53,66.23 60.53,116.94 v60.53,117.2
  Bottom 0.203: U5.PD1 56.84,118.69 57.96,117.57 60.16,117.57 v60.53,117.2
PD2  (via drill 0.35)  (1 unrouted)
  Top 0.203: v61.2,115.6 61,115.4 61,57 57.77,53.77 S30.3
  Bottom 0.203: U5.PD2 56.84,118.19 57.81,117.21 59.59,117.21 v61.2,115.6
PD3  (via drill 0.35)  (1 unrouted)
  Top 0.203: v61.9,114.4 63,113.3 63,49.1 57.77,43.88 S25.3
  Bottom 0.203: U5.PD3 56.83,117.69 57.67,116.86 58.74,116.86 61.2,114.4 v61.9,114.4
PD4  (via drill 0.35)  (1 unrouted)
  Top 0.203: v62.64,114.94 62.64,114.16 63.36,113.45 63.36,34.38 S20.4
  Bottom 0.203: U5.PD4 56.83,117.19 60.25,113.77 62.16,113.77 62.53,114.14 62.53,114.83 v62.64,114.94
PD5  (via drill 0.35)  (1 unrouted)
  Top 0.203: v63.34,114.36 63.34,113.97 63.71,113.59 63.71,24.74 S15.4
  Bottom 0.203: U5.PD5 56.71,116.69 59.99,113.41 62.31,113.41 63.25,114.36 v63.34,114.36
PD6  (via drill 0.35)  (1 unrouted)
  Top 0.203: v64.04,114.94 64.04,113.77 64.07,113.74 64.07,15.09 S10.4
  Bottom 0.203: U5.PD6 56.71,116.19 59.84,113.06 62.46,113.06 62.7,113.3 63.18,113.3 64.04,114.16 v64.04,114.94
PD7  (via drill 0.35)  (1 unrouted)
  Top 0.203: v64.7,114.3 64.7,113.7 64.42,113.42 64.42,16.64 64.45,16.55 64.42,16.5 64.42,6.32 62.23,4.12 S5.4
  Bottom 0.203: U5.PD7 56.7,115.69 59.69,112.7 63.08,112.7 64.68,114.3 v64.7,114.3
PD8  (via drill 0.35)  (1 unrouted)
  Top 0.203: v30.54,121.46 30.54,121.34 27.56,118.36 27.56,108.75 26.31,107.51 26.24,107.44 26.24,107.1 | S32.3 20.27,63.88 21.1,64.7 21.1,75 21.61,75.51 21.61,94 | 26.24,107.07 26.24,107.1 | 21.61,94 21.61,94.11 | 21.07,94.61 21.14,94.54 | 21.14,94.54 21.61,94.07 21.61,94 | 21.14,94.54 21.07,94.61 | 21.07,94.61 19.18,94.61 17.63,96.16 17.63,100.61 23.11,106.09 25.26,106.09 26.24,107.07 | 26.24,107.07 26.24,107.1
  Bottom 0.152: 31,122.4 31,121.92 30.64,121.56
  Bottom 0.203: U5.PD8 31,122.4 | 30.64,121.56 v30.54,121.46
PD9  (via drill 0.35)  (1 unrouted)
  Top 0.203: v30.15,120.05 29.1,119.01 29.1,109.7 27.5,108.1 27.41,108.1 26.67,107.36 26.67,106.96 25.44,105.73 23.26,105.73 17.98,100.46 17.98,96.31 19.32,94.97 21.26,94.97 21.97,94.26 21.97,94.06 21.97,75.31 21.46,74.8 21.46,55.06 20.27,53.88 S27.3
  Bottom 0.203: U5.PD9 31.5,121.41 v30.15,120.05
PD10  (via drill 0.35)  (1 unrouted)
  Top 0.203: v29.94,118.96 29.46,118.47 29.46,109.55 27.02,107.12 27.02,107 27.02,106.81 25.58,105.38 23.4,105.38 21.72,103.69 18.34,100.31 18.34,96.45 19.47,95.32 21.41,95.32 22.32,94.41 22.32,93.81 22.32,75.14 21.81,74.63 21.81,45.41 20.27,43.88 S22.3
  Bottom 0.203: U5.PD10 32,121.02 v29.94,118.96
PD11
  Bottom 0.203: R19.2 R20.1 31.9,125.5 32.5,124.9 U5.PD11
PD12  (via drill 0.35)  (1 unrouted)
  Top 0.203: v30.85,118.9 29.81,117.86 29.81,113.09 31.61,111.29 31.61,109.38 26.17,103.94 26.17,102.56 25.01,101.4 22.4,101.4 21.76,100.75 21.76,97.05 23.79,95.01 23.79,87.99 23.79,74.58 23.23,74.03 23.23,25.93 21.56,24.25 21.56,4.53 S2.3
  Bottom 0.203: v30.85,118.9 30.85,119.15 33,121.3 U5.PD12
PD13  (via drill 0.35)  (1 unrouted)
  Top 0.203: S28.3 32.77,53.77 34.57,55.57 34.57,87.16 34.57,88.08 37.19,90.71 43.99,97.5 45,97.5 46.89,97.5 48.39,99.01 50.76,101.38 51.63,101.38 51.83,101.57 53.11,102.85 53.11,104 53.11,105.46 52.03,106.54 52.03,106.56 50.96,107.62 50.6,107.62 48.78,107.62 47.65,106.5 47.09,106.5 46.77,106.81 42.39,106.81 42.22,106.64 41.36,106.64 40.75,107.25 40.75,108.15 40.29,108.61 38.17,108.61 36.94,109.83 36.55,109.83 34.89,111.5 34.89,116.41 33.4,117.89 v33.4,120.2
  Bottom 0.203: U5.PD13 33.5,120.3 v33.4,120.2
PD14  (via drill 0.35)  (1 unrouted)
  Top 0.203: v34.24,120.64 34.24,119.74 33.8,119.3 33.8,118 35.24,116.55 35.24,111.65 36.7,110.19 37.09,110.19 38.31,108.97 40.43,108.97 41.11,108.29 41.11,107.4 41.51,107 42.07,107 42.24,107.17 45.68,107.17 46.49,107.98 51.11,107.98 52.38,106.7 52.38,106.69 53.47,105.61 53.47,102.71 51.78,101.02 50.91,101.02 45.21,95.32 42.31,95.32 34.92,87.93 34.92,87.31 34.92,45.82 32.77,43.67 S23.3
  Bottom 0.203: v34.24,120.64 34,120.89 U5.PD14
PD15  (via drill 0.35)  (1 unrouted)
  Top 0.203: S18.3 32.77,33.67 35.28,36.18 35.28,87.79 42.46,94.97 45.36,94.97 51.06,100.67 51.93,100.67 53.82,102.56 53.82,105.75 52.74,106.83 52.74,106.85 51.26,108.33 46.35,108.33 45.54,107.52 42.96,107.52 41.16,109.32 38.46,109.32 37.24,110.55 36.85,110.55 35.6,111.79 35.6,116.7 34.43,117.87 v34.43,119
  Bottom 0.203: U5.PD15 34.5,121.28 34.88,120.9 34.88,119.67 34.4,119.2 34.4,119.03 v34.43,119
PE0  (via drill 0.35)
  Top 0.203: v39.2,122.1 33.5,127.8 33.5,138.6 34.3,139.4 34.3,143.06 v34.59,143.35
  Bottom 0.203: v34.59,143.35 34.25,143.01 J4.4 | v39.2,122.1 39.2,120.8 39.21,120.8 39.21,119.19 39.9,118.5 39.9,115.3 41.4,113.8 41.4,111.8 42.01,111.19 U5.PE0
PE1
  Bottom 0.203: U4.11 43.62,1.02 | R14.1 46.26,3.66 43.62,1.02 | 43.62,1.02 45,2.4 45,7.71 41.59,11.12 18.58,11.12 16.56,13.15 16.56,101.83 21.73,107 26.4,107 28.9,109.5 29.2,109.8 29.2,112.9 32.7,116.4 38.24,116.4 41.04,113.6 41.04,111.6 41.17,111.47 41.95,110.69 U5.PE1
PE2  (via drill 0.35)  (1 unrouted)
  Top 0.203: S29.3 45.27,54.48 47.17,56.37 47.17,88.68 54.32,95.84 54.32,99.04 56.67,101.38 56.67,106.96 54.15,109.47 52.46,111.16 52.42,111.2 47.5,111.2 46.9,111.2 45.9,112.2 40.7,112.2 40.4,112.2 38,114.6 v38,115.7
  Bottom 0.203: v38,115.7 38.29,115.7 40.69,113.3 40.69,111.45 41.6,110.54 41.6,109.5 41,108.9 U5.PE2
PE3  (via drill 0.35)  (1 unrouted)
  Top 0.203: S34.3 45.27,63.88 46.81,65.41 46.81,88.83 53.97,95.98 53.97,99.18 56.31,101.53 56.31,106.8 52.27,110.84 46.75,110.84 45.75,111.84 40.25,111.84 38.71,113.38 v38.31,113.38
  Bottom 0.203: v38.31,113.38 38.51,113.59 40.33,111.77 40.33,111.3 40.62,111.02 41.24,110.39 41.24,109.8 40.5,109.06 U5.PE3
PE4  (via drill 0.35)  (1 unrouted)
  Top 0.203: S39.3 45.27,73.88 46.46,75.06 46.46,91.26 53.3,98.1 | 53.3,98.1 53.31,98.11 | 53.3,98.1 53.31,98.11 | 53.31,98.11 53.31,99.03 55.95,101.67 55.95,106.65 52.12,110.49 46.6,110.49 45.6,111.49 39.7,111.49 v38.66,112.53
  Bottom 0.203: v38.66,112.53 38.66,112.47 40.89,110.24 40.89,109.95 40,109.06 U5.PE4
PE5  (via drill 0.35)  (1 unrouted)
  Top 0.203: S44.3 45.27,83.78 46.1,84.6 46.1,91.4 52.95,98.26 52.95,99.18 55.6,101.82 55.6,106.5 51.97,110.13 45.63,110.13 44.8,109.3 43.7,109.3 41.9,111.1 40.8,111.1 | 40.8,111.1 40.7,111.1 | 40.8,111.1 39.4,111.1 38.6,111.9 38.4,111.9 v37.7,112.6
  Bottom 0.203: U5.PE5 39.5,109.1 40.3,109.9 40.3,110.33 38.73,111.9 38.4,111.9 38.03,112.27 v37.7,112.6
PE6  (via drill 0.35)  (1 unrouted)
  Top 0.203: S49.3 47.44,93.25 52.6,98.41 52.6,99.33 55.24,101.97 55.24,106.36 51.83,109.78 45.78,109.78 44.95,108.94 43.55,108.94 41.75,110.74 40.7,110.74 | 40.7,110.74 40.6,110.74 | 40.7,110.74 39.05,110.74 37.83,111.97 37.44,111.97 37.07,112.34 37.07,112.86 37.3,113.09 v37.3,113.5
  Bottom 0.203: U5.PE6 39,109.1 39.9,110 39.9,110.22 38.58,111.54 38.25,111.54 37.83,111.97 37.44,111.97 37.07,112.34 37.07,113.27 v37.3,113.5
PE7  (via drill 0.35)  (1 unrouted)
  Top 0.203: v17.35,111.55 10.35,111.55 5.67,106.88 5.67,95.35 S46.3
  Bottom 0.203: U5.PE7 27.15,115.59 25.83,115.59 24.38,114.14 19.94,114.14 v17.35,111.55
PE8  (via drill 0.35)
  Top 0.203: v52.8,2.3 v52.79,2.29 v43.8,2.29
  Bottom 0.203: U4.10 v43.8,2.29 43.99,2.29 44,2.3 44.37,2.67 44.37,7.4 44.37,7.84 41.44,10.77 18.43,10.77 16.2,13 16.2,101.8 16.2,111.3 19.4,114.5 24.23,114.5 25.92,116.19 U5.PE8 | v52.8,2.3 53.41,2.92 53.4,2.93 R21.1
PE9
  Bottom 0.203: MEM1.1 7.75,115.45 8.38,116.08 8.39,116.07 19.47,116.07 19.7,116.3 24.6,116.3 24.99,116.69 U5.PE9
PE10
  Bottom 0.203: QMEM.6 23.43,117.97 24.21,117.19 U5.PE10
PE11  (via drill 0.35)
  Top 0.203: v16.1,118.1 15.9,117.9 v15.9,115.44
  Bottom 0.203: QMEM.1 v15.9,115.44 | v28.4,117.7 U5.PE11 24.31,117.69 23.4,118.6 16.6,118.6 v16.1,118.1
PE12
  Bottom 0.203: QMEM.5 23.45,119.25 24.51,118.19 U5.PE12
PE13  (via drill 0.35)
  Top 0.203: v28.5,121.2 28.9,121.6 28.9,122 29.23,122.34 29.23,137.53 31.5,139.8 v31.7,139.8
  Bottom 0.203: MEM1.6 10.01,118 11.29,116.7 QMEM.2 13.8,116.7 17.2,120.1 23.2,120.1 24.61,118.69 U5.PE13 27.99,118.69 28.5,119.2 v28.5,121.2 | v31.7,139.8 31.7,140.2 32.75,141.25 J4.1
PE14
  Bottom 0.203: MEM1.2 6.22,116.72 8.14,118.64 10.67,118.64 11.34,117.97 QMEM.3
  Bottom 0.254: QMEM.3 14.38,117.97 17,120.6 23.4,120.6 24.81,119.19 U5.PE14
PE15  (via drill 0.35)
  Top 0.203: v23.4,117 23.4,119 24.29,119.89 v25.2,119.89 25.2,122.8 28.7,126.3 28.7,137.8 31.5,140.6 v33.09,140.6 v33.1,140.6 | v16.9,116.8 16.9,119.7 v16.04,120.56
  Bottom 0.203: v16.9,116.8 17,116.7 QMEM.7 23.11,116.7 v23.4,117 | MEM1.5 10.51,120.2 v12.9,120.2 13.27,120.56 v16.04,120.56 | J4.2 33.25,140.76 v33.1,140.6
  Bottom 0.254: U5.PE15 25.91,119.69 25.71,119.89 v25.2,119.89
USB_N
  Bottom 0.203: U5.PA11 38.5,124.45 38.57,124.52 38.57,126.47 50.05,137.96 54.86,137.96 56,139.1 55.99,139.11 55.99,139.46 55.18,140.27 ESD.6
USB_P
  Bottom 0.203: U5.PA12 39,124.45 38.93,124.52 38.93,126.33 50.2,137.6 55,137.6 56.6,139.2 56.6,139.73 57.08,140.21 ESD.4
VBUS  (via drill 0.35)
  Top 0.203: v54.7,144.1 40.3,144.1 39.1,142.9 39.1,137.85 39.1,133.04 v34.61,128.55
  Route2 0.61: v54.7,144.1 58.2,144.1 58.8,143.5 v58.8,143.4
  Bottom 0.152: 55.23,144.63 v54.7,144.1
  Bottom 0.203: v34.61,128.55 R19.1
  Bottom 0.406: 54.2,142.2 54.5,141.9 | 54.2,143.6 v54.7,144.1 55.1,144.5
  Bottom 0.508: J1.1 55.23,144.63 55.1,144.5 v54.7,144.1 54.2,143.6 54.2,142.2 54.5,141.9 54.6,141.8 55.8,141.8 56.13,141.47 ESD.5
  Bottom 0.61: F1.1 C10.1 58.9,143.3 v58.8,143.4

## Text on the board
FRONTLABELS: 2nd | < | O | > | CLEAR | F1 | XOR | UNICODE/ / ASCII | PUSH / BT | POP / BT | 2's | OCT | DEC | HEX | NOR | 1's | << | ( O ) | OR | RoR | D | E | F | AND | RoL | A | B | C | / | X>>Y | 7 | 8 | 9 | X | X<<Y | 4 | 5 | 6 | - | BYTE FLIP | 1 | 2 | 3 | + | WORD FLIP | FF | 0 | 00 | =
233bmp: /Users/scottohair/Google Drive (octalcalc@gmail.com)/Octal Dev/Graphics/Back Graphics.bmp